# EAGLE design Octaverter Rev 5 (EAGLE 9.0.0)
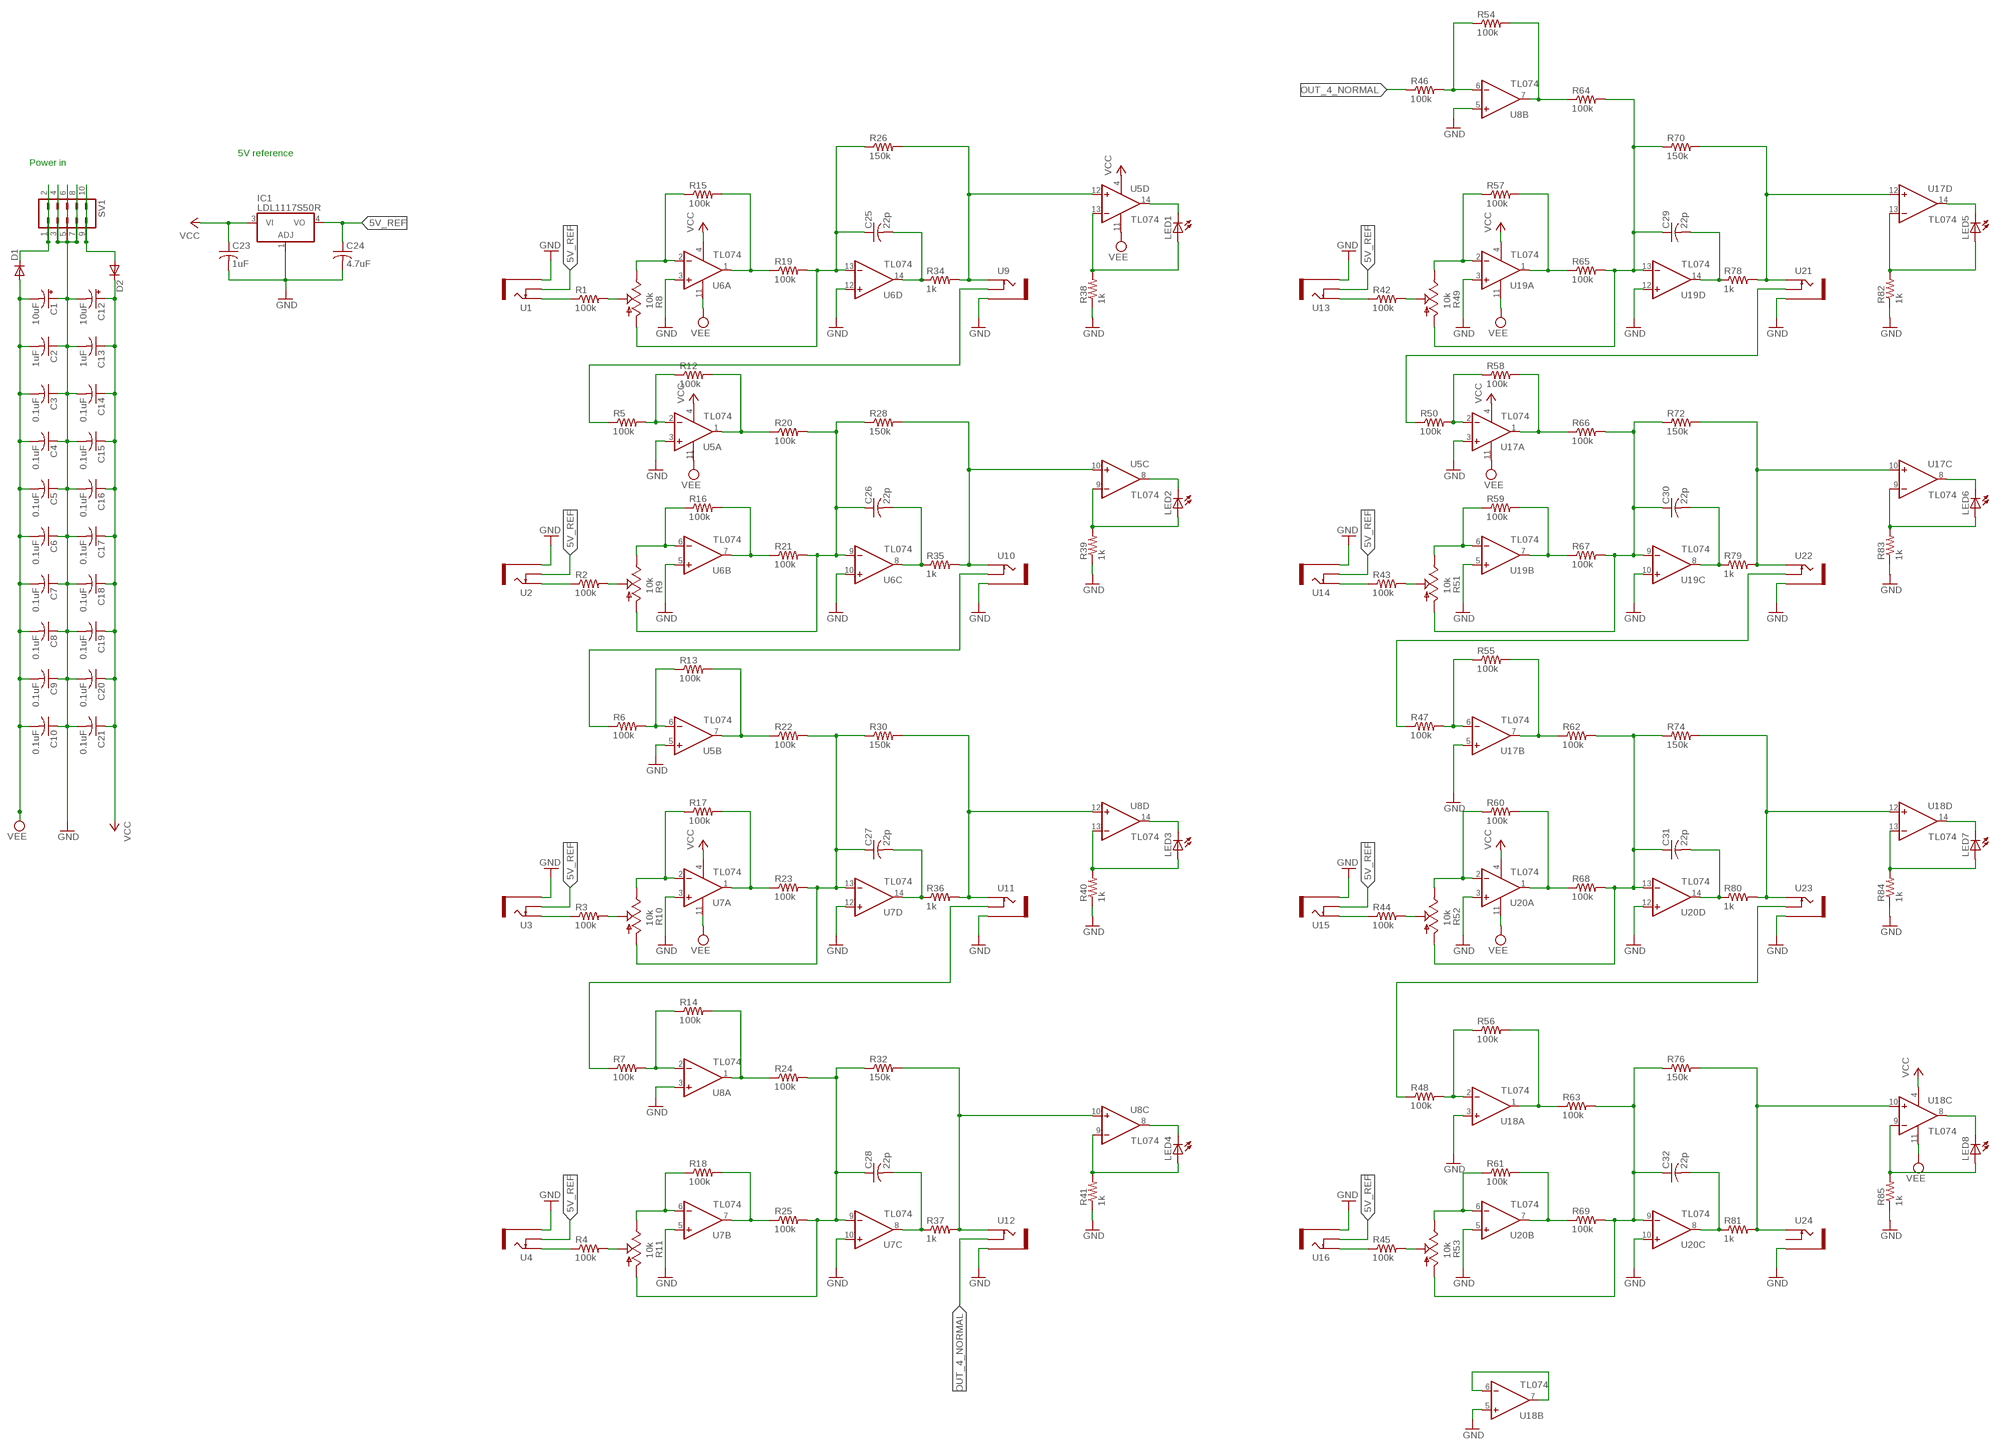
[diagram p0: schematic, sheet 1]

## Parts
C1  10uF  CPOL-USB  [PANASONIC_B]
C2  1uF  C-USC0603  [C0603]
C3  0.1uF  C-USC0603  [C0603]
C4  0.1uF  C-USC0603  [C0603]
C5  0.1uF  C-USC0603  [C0603]
C6  0.1uF  C-USC0603  [C0603]
C7  0.1uF  C-USC0603  [C0603]
C8  0.1uF  C-USC0603  [C0603]
C9  0.1uF  C-USC0603  [C0603]
C10  0.1uF  C-USC0603  [C0603]
C12  10uF  CPOL-USB  [PANASONIC_B]
C13  1uF  C-USC0603  [C0603]
C14  0.1uF  C-USC0603  [C0603]
C15  0.1uF  C-USC0603  [C0603]
C16  0.1uF  C-USC0603  [C0603]
C17  0.1uF  C-USC0603  [C0603]
C18  0.1uF  C-USC0603  [C0603]
C19  0.1uF  C-USC0603  [C0603]
C20  0.1uF  C-USC0603  [C0603]
C21  0.1uF  C-USC0603  [C0603]
C23  1uF  C-USC0603  [C0603]
C24  4.7uF  C-USC0603  [C0603]
C25  22p  C-USC0603  [C0603]
C26  22p  C-USC0603  [C0603]
C27  22p  C-USC0603  [C0603]
C28  22p  C-USC0603  [C0603]
C29  22p  C-USC0603  [C0603]
C30  22p  C-USC0603  [C0603]
C31  22p  C-USC0603  [C0603]
C32  22p  C-USC0603  [C0603]
D1  1N5819HW  DIODE-SOD123  [SOD123]
D2  1N5819HW  DIODE-SOD123  [SOD123]
IC1  LDL1117S50R  317EMP  [SOT223]
LED1  LED3MM  [LED3MM]
LED2  LED3MM  [LED3MM]
LED3  LED3MM  [LED3MM]
LED4  LED3MM  [LED3MM]
LED5  LED3MM  [LED3MM]
LED6  LED3MM  [LED3MM]
LED7  LED3MM  [LED3MM]
LED8  LED3MM  [LED3MM]
R1  100k  R-US_R0603  [R0603]
R2  100k  R-US_R0603  [R0603]
R3  100k  R-US_R0603  [R0603]
R4  100k  R-US_R0603  [R0603]
R5  100k  R-US_R0603  [R0603]
R6  100k  R-US_R0603  [R0603]
R7  100k  R-US_R0603  [R0603]
R8  10k  POT_USVERTICAL_PS  [ALPS_POT_VERTICAL_PS]
R9  10k  POT_USVERTICAL_PS  [ALPS_POT_VERTICAL_PS]
R10  10k  POT_USVERTICAL_PS  [ALPS_POT_VERTICAL_PS]
R11  10k  POT_USVERTICAL_PS  [ALPS_POT_VERTICAL_PS]
R12  100k  R-US_R0603  [R0603]
R13  100k  R-US_R0603  [R0603]
R14  100k  R-US_R0603  [R0603]
R15  100k  R-US_R0603  [R0603]
R16  100k  R-US_R0603  [R0603]
R17  100k  R-US_R0603  [R0603]
R18  100k  R-US_R0603  [R0603]
R19  100k  R-US_R0603  [R0603]
R20  100k  R-US_R0603  [R0603]
R21  100k  R-US_R0603  [R0603]
R22  100k  R-US_R0603  [R0603]
R23  100k  R-US_R0603  [R0603]
R24  100k  R-US_R0603  [R0603]
R25  100k  R-US_R0603  [R0603]
R26  150k  R-US_R0603  [R0603]
R28  150k  R-US_R0603  [R0603]
R30  150k  R-US_R0603  [R0603]
R32  150k  R-US_R0603  [R0603]
R34  1k  R-US_R0603  [R0603]
R35  1k  R-US_R0603  [R0603]
R36  1k  R-US_R0603  [R0603]
R37  1k  R-US_R0603  [R0603]
R38  1k  R-US_R0603  [R0603]
R39  1k  R-US_R0603  [R0603]
R40  1k  R-US_R0603  [R0603]
R41  1k  R-US_R0603  [R0603]
R42  100k  R-US_R0603  [R0603]
R43  100k  R-US_R0603  [R0603]
R44  100k  R-US_R0603  [R0603]
R45  100k  R-US_R0603  [R0603]
R46  100k  R-US_R0603  [R0603]
R47  100k  R-US_R0603  [R0603]
R48  100k  R-US_R0603  [R0603]
R49  10k  POT_USVERTICAL_PS  [ALPS_POT_VERTICAL_PS]
R50  100k  R-US_R0603  [R0603]
R51  10k  POT_USVERTICAL_PS  [ALPS_POT_VERTICAL_PS]
R52  10k  POT_USVERTICAL_PS  [ALPS_POT_VERTICAL_PS]
R53  10k  POT_USVERTICAL_PS  [ALPS_POT_VERTICAL_PS]
R54  100k  R-US_R0603  [R0603]
R55  100k  R-US_R0603  [R0603]
R56  100k  R-US_R0603  [R0603]
R57  100k  R-US_R0603  [R0603]
R58  100k  R-US_R0603  [R0603]
R59  100k  R-US_R0603  [R0603]
R60  100k  R-US_R0603  [R0603]
R61  100k  R-US_R0603  [R0603]
R62  100k  R-US_R0603  [R0603]
R63  100k  R-US_R0603  [R0603]
R64  100k  R-US_R0603  [R0603]
R65  100k  R-US_R0603  [R0603]
R66  100k  R-US_R0603  [R0603]
R67  100k  R-US_R0603  [R0603]
R68  100k  R-US_R0603  [R0603]
R69  100k  R-US_R0603  [R0603]
R70  150k  R-US_R0603  [R0603]
R72  150k  R-US_R0603  [R0603]
R74  150k  R-US_R0603  [R0603]
R76  150k  R-US_R0603  [R0603]
R78  1k  R-US_R0603  [R0603]
R79  1k  R-US_R0603  [R0603]
R80  1k  R-US_R0603  [R0603]
R81  1k  R-US_R0603  [R0603]
R82  1k  R-US_R0603  [R0603]
R83  1k  R-US_R0603  [R0603]
R84  1k  R-US_R0603  [R0603]
R85  1k  R-US_R0603  [R0603]
SV1  EURO_POWER_HEADERFAT_PADS  [EURO_PWR_HEADER_FAT]
U1  THONKICONNNEW  [WQP-PJ301M-12_JACK]
U2  THONKICONNNEW  [WQP-PJ301M-12_JACK]
U3  THONKICONNNEW  [WQP-PJ301M-12_JACK]
U4  THONKICONNNEW  [WQP-PJ301M-12_JACK]
U5  TL074  TL074_SMD  [SO14]
U6  TL074  TL074_SMD  [SO14]
U7  TL074  TL074_SMD  [SO14]
U8  TL074  TL074_SMD  [SO14]
U9  THONKICONNNEW  [WQP-PJ301M-12_JACK]
U10  THONKICONNNEW  [WQP-PJ301M-12_JACK]
U11  THONKICONNNEW  [WQP-PJ301M-12_JACK]
U12  THONKICONNNEW  [WQP-PJ301M-12_JACK]
U13  THONKICONNNEW  [WQP-PJ301M-12_JACK]
U14  THONKICONNNEW  [WQP-PJ301M-12_JACK]
U15  THONKICONNNEW  [WQP-PJ301M-12_JACK]
U16  THONKICONNNEW  [WQP-PJ301M-12_JACK]
U17  TL074  TL074_SMD  [SO14]
U18  TL074  TL074_SMD  [SO14]
U19  TL074  TL074_SMD  [SO14]
U20  TL074  TL074_SMD  [SO14]
U21  THONKICONNNEW  [WQP-PJ301M-12_JACK]
U22  THONKICONNNEW  [WQP-PJ301M-12_JACK]
U23  THONKICONNNEW  [WQP-PJ301M-12_JACK]
U24  THONKICONNNEW  [WQP-PJ301M-12_JACK]

## Nets
5V_REF: C24.1 IC1.4(VO) U1.P$2_SWITCH(SWITCH) U2.P$2_SWITCH(SWITCH) U3.P$2_SWITCH(SWITCH) U4.P$2_SWITCH(SWITCH) U13.P$2_SWITCH(SWITCH) U14.P$2_SWITCH(SWITCH) U15.P$2_SWITCH(SWITCH) U16.P$2_SWITCH(SWITCH)
GND: C1.+ C2.1 C3.1 C4.1 C5.1 C6.1 C7.1 C8.1 C9.1 C10.1 C12.- C13.2 C14.2 C15.2 C16.2 C17.2 C18.2 C19.2 C20.2 C21.2 C23.2 C24.2 IC1.1(ADJ) R38.1 R39.1 R40.1 R41.1 R82.1 R83.1 R84.1 R85.1 SV1.3 SV1.4 SV1.5 SV1.6 SV1.7 SV1.8 U1.P$3_SLEEVE(SLEEVE) U2.P$3_SLEEVE(SLEEVE) U3.P$3_SLEEVE(SLEEVE) U4.P$3_SLEEVE(SLEEVE) U5.3(A:+IN) U5.5(B:+IN) U6.3(A:+IN) U6.5(B:+IN) U6.10(C:+IN) U6.12(D:+IN) U7.3(A:+IN) U7.5(B:+IN) U7.10(C:+IN) U7.12(D:+IN) U8.3(A:+IN) U8.5(B:+IN) U9.P$3_SLEEVE(SLEEVE) U10.P$3_SLEEVE(SLEEVE) U11.P$3_SLEEVE(SLEEVE) U12.P$3_SLEEVE(SLEEVE) U13.P$3_SLEEVE(SLEEVE) U14.P$3_SLEEVE(SLEEVE) U15.P$3_SLEEVE(SLEEVE) U16.P$3_SLEEVE(SLEEVE) U17.3(A:+IN) U17.5(B:+IN) U18.3(A:+IN) U18.5(B:+IN) U19.3(A:+IN) U19.5(B:+IN) U19.10(C:+IN) U19.12(D:+IN) U20.3(A:+IN) U20.5(B:+IN) U20.10(C:+IN) U20.12(D:+IN) U21.P$3_SLEEVE(SLEEVE) U22.P$3_SLEEVE(SLEEVE) U23.P$3_SLEEVE(SLEEVE) U24.P$3_SLEEVE(SLEEVE)
N$1: R1.1 U1.P$1_TIP(TIP)
N$2: R1.2 R8.P$2(S)
N$3: R8.P$1(E) R15.1 U6.2(A:-IN)
N$4: R15.2 R19.1 U6.1(A:OUT)
N$5: C25.1 R8.P$3(A) R19.2 R26.1 U6.13(D:-IN)
N$6: R2.1 U2.P$1_TIP(TIP)
N$7: D1.C SV1.1 SV1.2
N$8: C25.2 R34.1 U6.14(D:OUT)
N$9: R26.2 R34.2 U5.12(D:+IN) U9.P$1_TIP(TIP)
N$10: R16.2 R21.1 U6.7(B:OUT)
N$11: R3.1 U3.P$1_TIP(TIP)
N$12: R3.2 R10.P$2(S)
N$13: C26.2 R35.1 U6.8(C:OUT)
N$14: LED1.K(C) U5.14(D:OUT)
N$15: LED1.A R38.2 U5.13(D:-IN)
N$17: R2.2 R9.P$2(S)
N$18: R9.P$1(E) R16.1 U6.6(B:-IN)
N$19: R50.1 U21.P$2_SWITCH(SWITCH)
N$20: R10.P$1(E) R17.1 U7.2(A:-IN)
N$21: LED2.K(C) U5.8(C:OUT)
N$22: LED2.A R39.2 U5.9(C:-IN)
N$23: D2.A SV1.9 SV1.10
N$24: R17.2 R23.1 U7.1(A:OUT)
N$25: C27.1 R10.P$3(A) R22.2 R23.2 R30.1 U7.13(D:-IN)
N$26: C27.2 R36.1 U7.14(D:OUT)
N$27: U18.6(B:-IN) U18.7(B:OUT)
N$28: R4.2 R11.P$2(S)
N$29: R11.P$1(E) R18.1 U7.6(B:-IN)
N$30: C28.1 R11.P$3(A) R24.2 R25.2 R32.1 U7.9(C:-IN)
N$31: R4.1 U4.P$1_TIP(TIP)
N$32: R18.2 R25.1 U7.7(B:OUT)
N$33: C28.2 R37.1 U7.8(C:OUT)
N$35: LED3.K(C) U8.14(D:OUT)
N$36: LED3.A R40.2 U8.13(D:-IN)
N$37: LED4.K(C) U8.8(C:OUT)
N$38: LED4.A R41.2 U8.9(C:-IN)
N$39: R42.1 U13.P$1_TIP(TIP)
N$40: R42.2 R49.P$2(S)
N$41: R49.P$1(E) R57.1 U19.2(A:-IN)
N$42: R57.2 R65.1 U19.1(A:OUT)
N$43: C29.1 R49.P$3(A) R64.2 R65.2 R70.1 U19.13(D:-IN)
N$44: C29.2 R78.1 U19.14(D:OUT)
N$46: LED5.K(C) U17.14(D:OUT)
N$47: LED5.A R82.2 U17.13(D:-IN)
N$48: R43.2 R51.P$2(S)
N$49: R51.P$1(E) R59.1 U19.6(B:-IN)
N$50: C30.1 R51.P$3(A) R66.2 R67.2 R72.1 U19.9(C:-IN)
N$51: R43.1 U14.P$1_TIP(TIP)
N$52: R59.2 R67.1 U19.7(B:OUT)
N$53: C30.2 R79.1 U19.8(C:OUT)
N$55: LED6.K(C) U17.8(C:OUT)
N$56: LED6.A R83.2 U17.9(C:-IN)
N$57: R44.1 U15.P$1_TIP(TIP)
N$58: R44.2 R52.P$2(S)
N$59: R52.P$1(E) R60.1 U20.2(A:-IN)
N$60: R60.2 R68.1 U20.1(A:OUT)
N$61: C31.1 R52.P$3(A) R62.2 R68.2 R74.1 U20.13(D:-IN)
N$62: C31.2 R80.1 U20.14(D:OUT)
N$64: R45.2 R53.P$2(S)
N$65: R53.P$1(E) R61.1 U20.6(B:-IN)
N$66: C32.1 R53.P$3(A) R63.2 R69.2 R76.1 U20.9(C:-IN)
N$67: R45.1 U16.P$1_TIP(TIP)
N$68: R61.2 R69.1 U20.7(B:OUT)
N$69: C32.2 R81.1 U20.8(C:OUT)
N$71: LED7.A R84.2 U18.13(D:-IN)
N$72: LED8.A R85.2 U18.9(C:-IN)
N$73: LED7.K(C) U18.14(D:OUT)
N$74: LED8.K(C) U18.8(C:OUT)
N$75: R5.1 U9.P$2_SWITCH(SWITCH)
N$76: R5.2 R12.1 U5.2(A:-IN)
N$77: C26.1 R9.P$3(A) R20.2 R21.2 R28.1 U6.9(C:-IN)
N$78: R12.2 R20.1 U5.1(A:OUT)
N$79: R6.1 U10.P$2_SWITCH(SWITCH)
N$80: R6.2 R13.1 U5.6(B:-IN)
N$81: R13.2 R22.1 U5.7(B:OUT)
N$82: R50.2 R58.1 U17.2(A:-IN)
N$83: R7.1 U11.P$2_SWITCH(SWITCH)
N$84: R7.2 R14.1 U8.2(A:-IN)
N$85: R14.2 R24.1 U8.1(A:OUT)
N$86: R58.2 R66.1 U17.1(A:OUT)
N$88: R47.1 U22.P$2_SWITCH(SWITCH)
N$89: R47.2 R55.1 U17.6(B:-IN)
N$90: R55.2 R62.1 U17.7(B:OUT)
N$92: R48.1 U23.P$2_SWITCH(SWITCH)
N$93: R48.2 R56.1 U18.2(A:-IN)
N$94: R56.2 R63.1 U18.1(A:OUT)
N$95: R46.2 R54.1 U8.6(B:-IN)
N$96: R54.2 R64.1 U8.7(B:OUT)
N$97: R30.2 R36.2 U8.12(D:+IN) U11.P$1_TIP(TIP)
N$98: R32.2 R37.2 U8.10(C:+IN) U12.P$1_TIP(TIP)
N$101: R76.2 R81.2 U18.10(C:+IN) U24.P$1_TIP(TIP)
N$102: R28.2 R35.2 U5.10(C:+IN) U10.P$1_TIP(TIP)
N$103: R74.2 R80.2 U18.12(D:+IN) U23.P$1_TIP(TIP)
N$105: R72.2 R79.2 U17.10(C:+IN) U22.P$1_TIP(TIP)
N$107: R70.2 R78.2 U17.12(D:+IN) U21.P$1_TIP(TIP)
OUT_4_NORMAL: R46.1 U12.P$2_SWITCH(SWITCH)
VCC: C12.+ C13.1 C14.1 C15.1 C16.1 C17.1 C18.1 C19.1 C20.1 C21.1 C23.1 D2.C IC1.3(VI) U5.4(P:V+) U6.4(P:V+) U7.4(P:V+) U8.4(P:V+) U17.4(P:V+) U18.4(P:V+) U19.4(P:V+) U20.4(P:V+)
VEE: C1.- C2.2 C3.2 C4.2 C5.2 C6.2 C7.2 C8.2 C9.2 C10.2 D1.A U5.11(P:V-) U6.11(P:V-) U7.11(P:V-) U8.11(P:V-) U17.11(P:V-) U18.11(P:V-) U19.11(P:V-) U20.11(P:V-)
Unconnected: U24.P$2_SWITCH(SWITCH)

## Notes on the sheet
- 5V reference
- Power in

## Library data of the parts
C1 C12 = adafruit:CPOL-US: POLARIZED CAPACITOR, American symbol
C2-C10 C13-C21 C23-C32 = adafruit:C-US: CAPACITOR, American symbol
D1 D2 = diode:DIODE-: DIODE
IC1 = linear:*317: Positive VOLTAGE REGULATOR
LED1-LED8 = adafruit:LED: LED OSRAM: - CHIPLED LG R971, LG N971, LY N971, LG Q971, LY Q971, LO R971, LY R971 LH N974, LH R974 LS Q976, LO Q976, LY Q976 LO Q996 - Hyper CHIPLED LW Q18S LB Q993, LB Q99A, LB R99A - SideLED LS A670, LO A670, LY A670, LG A670, LP A670 LB A673, LV A673, LT A673, LW A673 LH A674 LY A675 LS A676, LA A676, LO A676, LY A676, LW A676 LS A679, LY A679, LG A679 - Hyper Micro SIDELED® LS Y876, LA Y876, LO Y876, LY Y876 LT Y87S - SmartLED LW L88C, LW L88S LB L89C, LB L89S, LG L890 LS L89K, LO L89K, LY L89K LS L896, LA L896, LO L896, LY L896 - TOPLED LS T670, LO T670, LY T670, LG T670, LP T670 LSG T670, LSP T670, LSY T670, LOP T670, LYG T670 LG T671, LOG T671, LSG T671 LB T673, LV T673, LT T673, LW T673 LH T674 LS T676, LA T676, LO T676, LY T676, LB T676, LH T676, LSB T676, LW T676 LB T67C, LV T67C, LT T67C, LS T67K, LO T67K, LY T67K, LW E67C LS E67B, LA E67B, LO E67B, LY E67B, LB E67C, LV E67C, LT E67C LW T67C LS T679, LY T679, LG T679 LS T770, LO T770, LY T770, LG T770, LP T770 LB T773, LV T773, LT T773, LW T773 LH T774 LS E675, LA E675, LY E675, LS T675 LS T776, LA T776, LO T776, LY T776, LB T776 LHGB T686 LT T68C, LB T68C - Hyper Mini TOPLED® LB M676 - Mini TOPLED Santana® LG M470 LS M47K, LO M47K, LY M47K Source: http://www.osram.convergy.de/
R1-R7 R12-R26 R28 R30 R32 R34-R48 R50 R54-R70 R72 R74 R76 R78-R85 = adafruit:R-US_: RESISTOR, American symbol
R8-R11 R49 R51-R53 = pot-alps:POT_US
SV1 = MusicThingModular:EURO_POWER_HEADER: Power Header 10 pin power header for Eurorack Power Supplies Variants with fatter pads for easier soldering, and the LOCK variant which has 5mil offset pins to hold the component in place before soldering
U1-U4 U9-U16 U21-U24 = MusicThingModular:THONKICONN: 3.5mm socket for Eurorack modular synths
U5-U8 U17-U20 = MusicThingModular:TL074: Generic Quad Op Amp

## Board
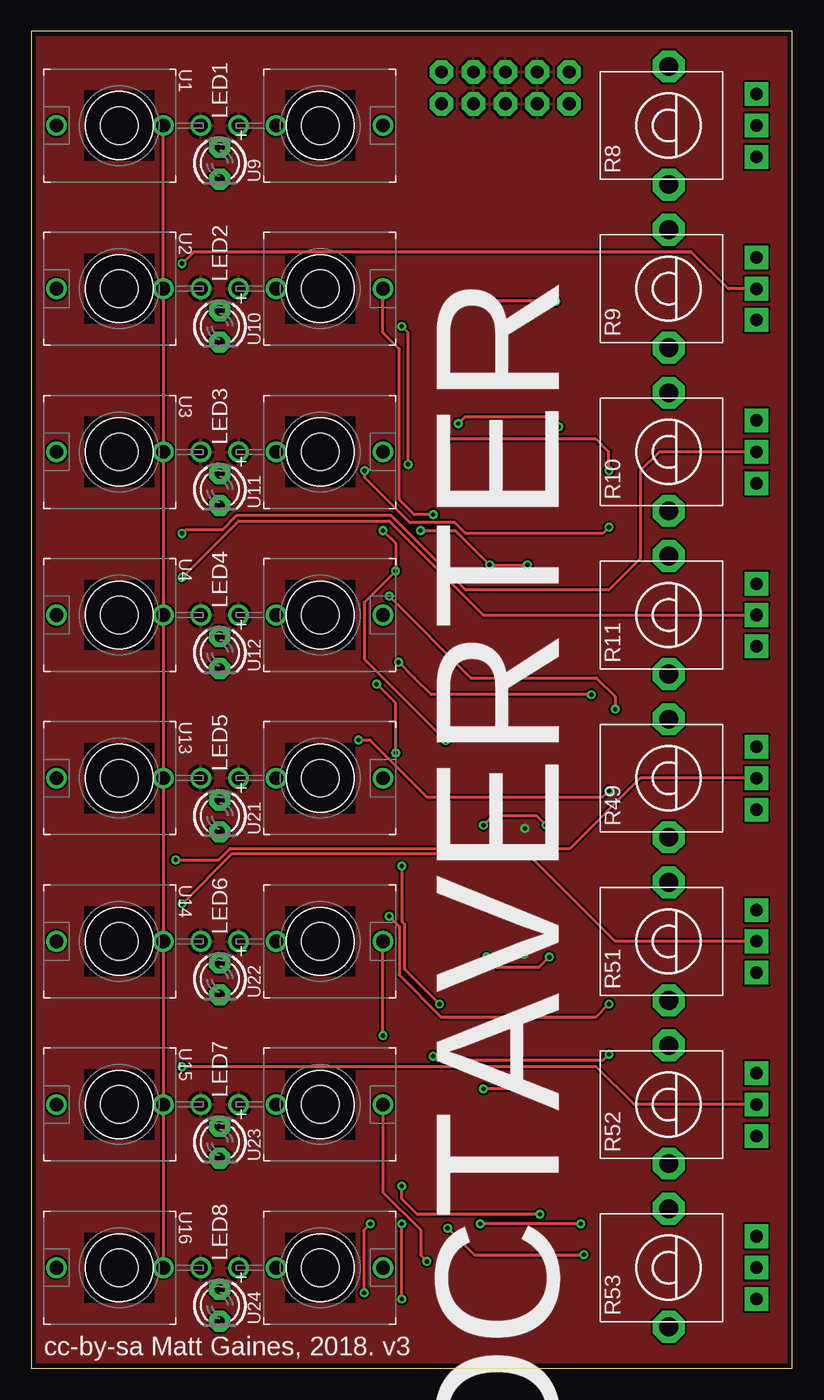
[diagram p1: board, top side]
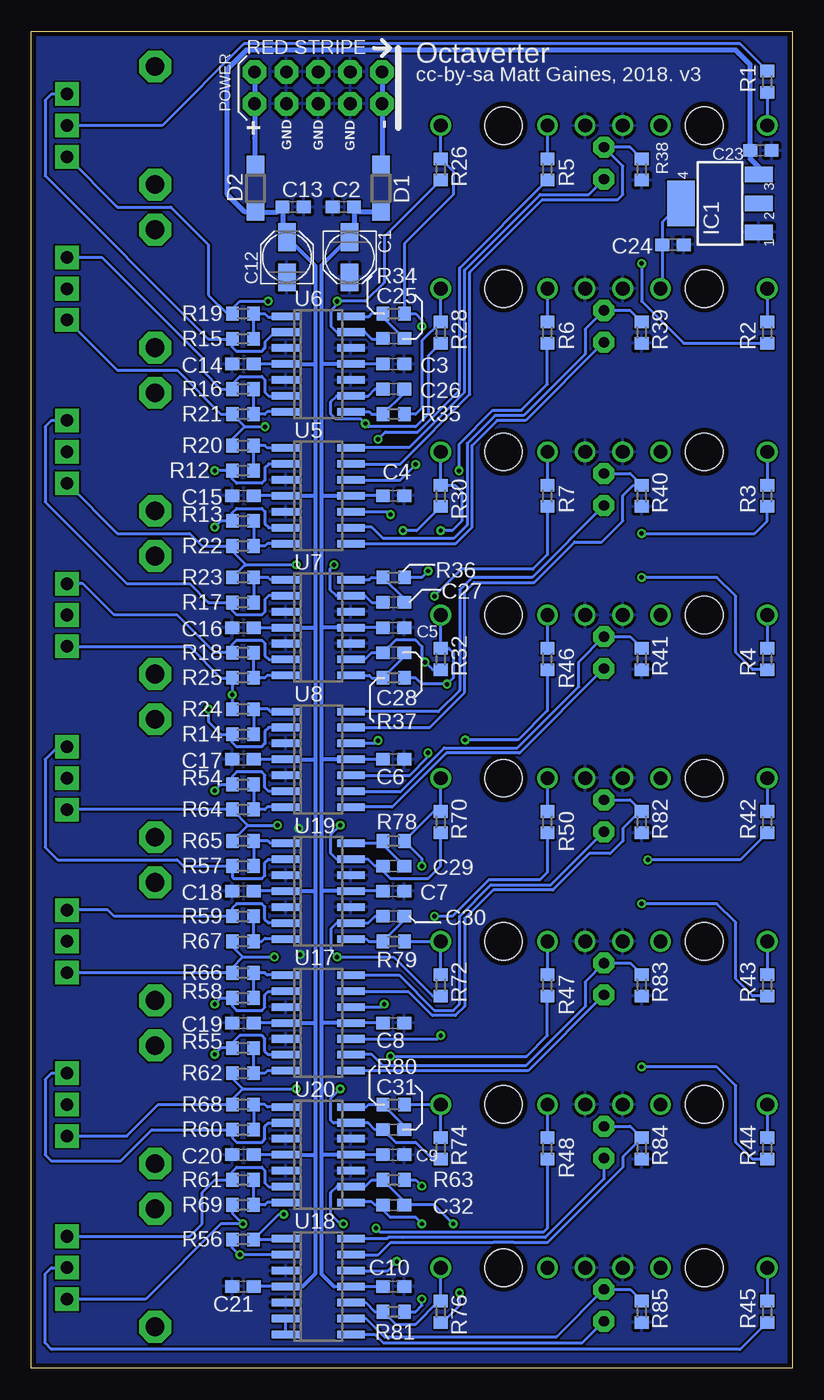
[diagram p2: board, bottom side, seen from below]

Size 60.6 x 106.5 mm. Coordinates in mm from the lower left corner, seen from the top.
Outline: 0,0 60.6,0 60.6,106.5 0,106.5 0,0
Copper layers (1*16): Top 0.0356mm / dielectric 1.5011mm / Bottom 0.0356mm
Design rules "oshpark-2layer": minimum track width 6mil, minimum drill 13mil, track to track 6mil, track to pad 6mil, pad to pad 6mil, via to via 6mil, smd to smd 6mil, copper to edge 15mil, drill to drill 6mil, minimum pad ring 7mil, minimum via ring 7mil, stop-mask expansion 2.5mil, vias tented up to drill 0mil, thermal gap 10mil
Holes 3 mm at 23,99 7,99 7,86 23,86 23,73 7,73 7,60 23,60 23,47 7,47 7,34 23,34 23,21 7,21 7,8 23,8

### Footprints (pad centres in the part's own frame; a part is rotated, then mirrored left to right if it is on the bottom)
PANASONIC_B = smd 2.2 x 1.4: + 1.6,0; - -1.6,0
C0603 = smd 1.1 x 1: 1 -0.85,0; 2 0.85,0
SOD123 = smd 1.4 x 1.4: A 1.9,0; C -1.9,0
SOT223 = smd 1.219 x 2.235: 1 -2.311,-3.099; 2 0,-3.099; 3 2.311,-3.099 | smd 3.6 x 2.2: 4 0,3.099
LED3MM = drill 0.813 pad 1.676 octagon: A -1.27,0; K 1.27,0
R0603 = smd 1 x 1.1: 1 -0.85,0; 2 0.85,0
ALPS_POT_VERTICAL_PS = drill 1 pad 1.88 square: P$1 -2.5,7; P$2 0,7; P$3 2.5,7 | drill 1.5 pad 2.54 octagon: P$4 -4.7,0; P$5 4.7,0
EURO_PWR_HEADER_FAT = drill 1.016 pad 1.88 octagon: 1 -5.08,-1.27; 2 -5.08,1.27; 3 -2.54,-1.27; 4 -2.54,1.27; 5 0,-1.27; 6 0,1.27; 7 2.54,-1.27; 8 2.54,1.27; 9 5.08,-1.27; 10 5.08,1.27
WQP-PJ301M-12_JACK = drill 1.1: P$1_TIP 0,5; P$2_SWITCH 0,-3.5; P$3_SLEEVE 0,-6.5
SO14 = smd 0.6 x 2.2: 1 -3.81,-2.6; 2 -2.54,-2.6; 3 -1.27,-2.6; 4 0,-2.6; 5 1.27,-2.6; 6 2.54,-2.6; 7 3.81,-2.6; 8 3.81,2.6; 9 2.54,2.6; 10 1.27,2.6; 11 0,2.6; 12 -1.27,2.6; 13 -2.54,2.6; 14 -3.81,2.6

### Placement (x,y rotation side)
C1  35.25,88.5 270 bottom
C2  35.75,92.5 0 bottom
C3  31.75,80 180 bottom
C4  31.75,69.5 180 bottom
C5  31.75,59 180 bottom
C6  31.75,48.5 180 bottom
C7  31.75,38 180 bottom
C8  31.75,27.5 180 bottom
C9  31.75,17 180 bottom
C10  31.75,6.5 180 bottom
C12  40.25,88.5 90 bottom
C13  39.75,92.5 0 bottom
C14  43.75,80 180 bottom
C15  43.75,69.5 180 bottom
C16  43.75,59 180 bottom
C17  43.75,48.5 180 bottom
C18  43.75,38 180 bottom
C19  43.75,27.5 180 bottom
C20  43.75,17 180 bottom
C21  43.75,6.5 180 bottom
C23  2.5,97 0 bottom
C24  9.5,89.5 0 bottom
C25  31.74,82.03 0 bottom
C26  31.75,78 0 bottom
C27  31.75,61 0 bottom
C28  31.75,57 0 bottom
C29  31.75,40 0 bottom
C30  31.75,36 0 bottom
C31  31.75,19 0 bottom
C32  31.75,13 180 bottom
D1  32.75,94 270 bottom
D2  42.75,94 90 bottom
IC1  5.76,92.8 90 bottom
LED1  15,96 270 top
LED2  15,83 270 top
LED3  15,70 270 top
LED4  15,57 270 top
LED5  15,44 270 top
LED6  15,31 270 top
LED7  15,18 270 top
LED8  15,5 270 top
R1  2,102.5 90 bottom
R2  2,82.5 270 bottom
R3  2,69.5 270 bottom
R4  2,56.5 270 bottom
R5  19.5,95.5 270 bottom
R6  19.5,82.5 270 bottom
R7  19.5,69.5 270 bottom
R8  50.75,99 270 top
R9  50.75,86 270 top
R10  50.75,73 270 top
R11  50.75,60 270 top
R12  43.75,71.5 0 bottom
R13  43.75,67.5 0 bottom
R14  43.75,50.5 0 bottom
R15  43.75,82 0 bottom
R16  43.75,78 0 bottom
R17  43.75,61 0 bottom
R18  43.75,57 0 bottom
R19  43.75,84 180 bottom
R20  43.75,73.5 180 bottom
R21  43.75,76 180 bottom
R22  43.75,65.5 180 bottom
R23  43.75,63 180 bottom
R24  43.75,52.5 180 bottom
R25  43.75,55 180 bottom
R26  28,95.5 90 bottom
R28  28,82.5 90 bottom
R30  28,69.5 90 bottom
R32  28,56.5 90 bottom
R34  31.75,84 0 bottom
R35  31.75,76 0 bottom
R36  31.75,63 0 bottom
R37  31.75,55 0 bottom
R38  12,95.5 90 bottom
R39  12,82.5 90 bottom
R40  12,69.5 90 bottom
R41  12,56.5 90 bottom
R42  2,43.5 270 bottom
R43  2,30.5 270 bottom
R44  2,17.5 270 bottom
R45  2,4.5 270 bottom
R46  19.5,56.5 270 bottom
R47  19.5,30.5 270 bottom
R48  19.5,17.5 270 bottom
R49  50.75,47 270 top
R50  19.5,43.5 270 bottom
R51  50.75,34 270 top
R52  50.75,21 270 top
R53  50.75,8 270 top
R54  43.75,46.5 0 bottom
R55  43.75,25.5 0 bottom
R56  43.75,10.25 0 bottom
R57  43.75,40 0 bottom
R58  43.75,29.5 0 bottom
R59  43.75,36 0 bottom
R60  43.75,19 0 bottom
R61  43.75,15 0 bottom
R62  43.75,23.5 180 bottom
R63  31.75,15 180 bottom
R64  43.75,44.5 180 bottom
R65  43.75,42 180 bottom
R66  43.75,31.5 180 bottom
R67  43.75,34 180 bottom
R68  43.75,21 180 bottom
R69  43.75,13 180 bottom
R70  28,43.5 90 bottom
R72  28,30.5 90 bottom
R74  28,17.5 90 bottom
R76  28,4.5 90 bottom
R78  31.75,42 0 bottom
R79  31.75,34 0 bottom
R80  31.75,21 0 bottom
R81  31.75,4.5 180 bottom
R82  12,43.5 90 bottom
R83  12,30.5 90 bottom
R84  12,17.5 90 bottom
R85  12,4.5 90 bottom
SV1  37.75,102 180 bottom
U1  7,99 90 top
U2  7,86 90 top
U3  7,73 90 top
U4  7,60 90 top
U5  37.75,69.5 270 bottom
U6  37.75,80 270 bottom
U7  37.75,59 270 bottom
U8  37.75,48.5 270 bottom
U9  23,99 270 top
U10  23,86 270 top
U11  23,73 270 top
U12  23,60 270 top
U13  7,47 90 top
U14  7,34 90 top
U15  7,21 90 top
U16  7,8 90 top
U17  37.75,27.5 270 bottom
U18  37.75,6.5 270 bottom
U19  37.75,38 270 bottom
U20  37.75,17 270 bottom
U21  23,47 270 top
U22  23,34 270 top
U23  23,21 270 top
U24  23,8 270 top

### Tracks (layer width: path | path; a pad name or v marks a point on that pad's centre or on a via)
5V_REF
  Top 0.254: U1.P$2_SWITCH U2.P$2_SWITCH U3.P$2_SWITCH U4.P$2_SWITCH U13.P$2_SWITCH U14.P$2_SWITCH U15.P$2_SWITCH U16.P$2_SWITCH
  Bottom 0.254: IC1.4 10.35,91.31 C24.1 10.35,86.15 U2.P$2_SWITCH
GND  (via drill 0.35)
  other vias: 39.2,32.95 39.3,43
  pour Top: 61,107 61,-1 0,-1 0,107
  pour Bottom: 61,107.5 61,-1 -1,-1 -1,107.5
N$1
  Bottom 0.254: R1.1 U1.P$1_TIP
N$2
  Bottom 0.254: R1.2 4.15,105.5 43.68,105.5 50.18,99 R8.P$2
N$3
  Bottom 0.254: U6.2 41.21,82.54 42,81.75 42,81.25 42.25,81 44.25,81 44.6,81.35 R15.1 46.5,82 59.5,95 59.5,101 59,101.5 R8.P$1
N$4
  Bottom 0.254: R15.2 R19.1 42,84 41.75,83.75 40.41,83.75 U6.1
N$5  (via drill 0.35)
  Top 0.254: v41.75,85 v36.25,85
  Bottom 0.254: C25.1 32.62,82 33.5,82 34.04,82.54 U6.13 36.21,82.54 36.25,82.5 36.75,83 36.75,84.25 36.25,84.75 v36.25,85 34,85 32.5,86.5 32.5,90.15 R26.1 | v41.75,85 44,85 44.6,84.4 R19.2 45,84 46.5,85.5 46.5,89.5 49.5,92.5 53.75,92.5 R8.P$3
N$6
  Bottom 0.254: U2.P$1_TIP R2.1
N$7
  Bottom 0.406: SV1.1 SV1.2 32.67,95.98 D1.C
N$8
  Bottom 0.254: U6.14 35.09,83.75 33.75,83.75 33.5,84 R34.1 32.6,83.74 C25.2
N$9  (via drill 0.35)
  Top 0.254: v30,72 30,82.5 v29.5,83
  Bottom 0.254: U9.P$1_TIP R26.2 27,95.35 27,93.5 30.9,89.6 R34.2 30,84 29.5,83.5 v29.5,83 | U5.12 31.23,70.77 v30,72
N$10
  Bottom 0.254: R16.2 R21.1 42,76 41.81,76.19 U6.7
N$11
  Bottom 0.254: U3.P$1_TIP R3.1
N$12  (via drill 0.35)
  Top 0.254: R10.P$2 50,73 48.5,71.5 48.5,64.5 46,62 34.58,62 28.67,67.91 16.33,67.91 15.21,66.79 12.29,66.79 v12,66.5
  Bottom 0.254: v12,66.5 3,66.5 2,67.5 R3.2
N$13
  Bottom 0.254: U6.8 33.69,76.19 33.5,76 R35.1 30.9,77.7 C26.2
N$14
  Bottom 0.254: U5.14 35.09,73.37 30.48,73.37 26.09,77.76 26.09,87.48 20.07,93.5 16.23,93.5 LED1.K
N$15
  Bottom 0.254: R38.2 12.92,97.27 LED1.A 13.5,95.77 13.5,93.5 13.91,93.09 19.91,93.09 25.69,87.31 25.69,77.59 31.24,72.04 U5.13
N$17  (via drill 0.35)
  Top 0.254: R9.P$2 55.5,86 52.57,88.93 12.93,88.93 v12,88
  Bottom 0.254: v12,88 12,85 8.65,81.65 R2.2
N$18
  Bottom 0.254: U6.6 41.71,77.46 42,77.75 42,78.75 42.25,79 44,79 44.6,78.4 R16.1 45.5,78 47,79.5 47,80.5 55,88.5 R9.P$1
N$19
  Bottom 0.254: U21.P$2_SWITCH R50.1
N$20
  Bottom 0.254: U7.2 41.71,61.54 42,61.25 42,60.25 42.25,60 44.25,60 44.6,60.35 R17.1 46.5,61 48,62.5 53,62.5 59.5,69 59.5,75 59,75.5 R10.P$1
N$21
  Bottom 0.254: LED2.K 21.23,75.5 23.5,75.5 25.5,73.5 25.5,67 26.81,65.69 U5.8
N$22
  Bottom 0.254: R39.2 12.92,84.27 LED2.A 16.5,82.77 16.5,80.81 21.4,75.91 23.67,75.91 25.91,73.67 25.91,67.17 26.98,66.1 32.6,66.1 33.5,67 35.11,67 U5.9
N$23
  Bottom 0.406: SV1.9 SV1.10 42.83,98 42.83,95.98 D2.A
N$24
  Bottom 0.254: U7.1 41.56,62.81 41.75,63 R23.1 R17.2
N$25  (via drill 0.35)
  Top 0.254: v39.5,64 v36.5,64 33.77,66.73 v31,66.73
  Bottom 0.254: C27.1 33.5,61 34.04,61.54 U7.13 36.34,61.54 36.8,62 36.8,63.7 v36.5,64 | R10.P$3 53.75,66.5 48,66.5 47,65.5 R22.2 44.6,65.1 43.5,64 | v39.5,64 43.5,64 | R23.2 43.6,64 43.5,64 | R30.1 29.92,66.73 v31,66.73
N$26
  Bottom 0.254: U7.14 33.69,62.81 33.5,63 R36.1 30.9,61.3 C27.2
N$27
  Bottom 0.254: U18.7 U18.6
N$28  (via drill 0.35)
  Top 0.254: v12,63 16.5,67.5 28.5,67.5 36,60 R11.P$2
  Bottom 0.254: R4.2 3.15,55.65 4.5,57 4.5,61.5 6,63 v12,63
N$29
  Bottom 0.254: U7.6 41.71,56.46 42,56.75 42,57.75 42.25,58 44.25,58 44.6,57.65 R18.1 46,57 49,60 54,60 56.5,62.5 R11.P$1
N$30  (via drill 0.35)
  Top 0.254: v44.6,53.65 31.85,53.65 30.5,55 v29.25,56.25
  Bottom 0.254: U7.9 34.04,56.46 33.5,57 C28.1 31.6,58 30,58 29.5,57.5 29.5,56.5 v29.25,56.25 28.65,55.65 R32.1 | R11.P$3 48,57.5 45.5,55 R25.2 v44.6,53.65 R24.2
N$31
  Bottom 0.254: U4.P$1_TIP R4.1
N$32
  Bottom 0.254: U7.7 41.81,55.19 42,55 R25.1 R18.2
N$33
  Bottom 0.254: U7.8 33.69,55.19 33.5,55 R37.1 30.9,56.7 C28.2
N$35
  Bottom 0.254: LED3.K 20.73,63 25.5,63 26.5,62 26.5,54 28.19,52.31 U8.14
N$36
  Bottom 0.254: LED3.A 12.92,71.27 R40.2 12.65,70.35 13.5,69.5 13.5,67.5 15.17,65.83 17.33,65.83 20.56,62.59 25.33,62.59 26.09,61.83 26.09,53.83 28.89,51.04 U8.13
N$37
  Bottom 0.254: LED4.K 21.72,49.01 27.55,49.01 31.87,44.69 U8.8
N$38
  Bottom 0.254: R41.2 12.92,58.27 LED4.A 17,56.27 17,54.3 21.89,49.41 27.72,49.41 31.18,45.96 U8.9
N$39
  Bottom 0.254: U13.P$1_TIP R42.1
N$40  (via drill 0.35)
  Top 0.254: v11.5,40.5 14.93,40.5 15.83,41.41 42.91,41.41 48.5,47 R49.P$2
  Bottom 0.254: R42.2 4.15,40.5 v11.5,40.5
N$41
  Bottom 0.254: U19.2 41.71,40.54 42,40.25 42,39.25 42.25,39 44.5,39 44.6,39.1 R57.1 48.5,40 49,40.5 58.5,40.5 59.5,41.5 59.5,48.5 58.5,49.5 R49.P$1
N$42
  Bottom 0.254: U19.1 41.56,41.81 41.75,42 R65.1 R57.2
N$43  (via drill 0.35)
  Top 0.254: v41,43.25 40.25,44 36.75,44 v36,43.25
  Bottom 0.254: R65.2 43.35,43.25 | 43.35,43.25 v41,43.25 | 43.35,43.25 R64.2 R49.P$3 | v36,43.25 36.75,42.5 36.75,41 36.29,40.54 U19.13 33.79,40.54 33.25,40 C29.1 32.6,39.6 32,39 29,39 28,40 R70.1
N$44
  Bottom 0.254: R78.1 32.67,41.92 | 32.67,41.92 32.79,41.81 U19.14 | C29.2 32.67,41.77 32.67,41.92
N$46
  Bottom 0.254: U17.14 31.31,31.31 28.5,28.5 27,28.5 26.5,29 26.5,36 24,38.5 19.23,38.5 LED5.K
N$47
  Bottom 0.254: LED5.A 12.92,45.27 R82.2 12.15,44.35 13.5,43 13.5,42 14.5,41 16.16,41 19.06,38.09 23.83,38.09 26.09,35.83 26.09,28.83 26.83,28.09 28.67,28.09 30.54,29.96 35.07,29.96 U17.13
N$48  (via drill 0.35)
  Top 0.254: v12,37 16,41 39.5,41 46.5,34 R51.P$2
  Bottom 0.254: R43.2 3.15,29.65 4.5,31 4.5,35.5 6,37 v12,37
N$49
  Bottom 0.254: U19.6 41.71,35.46 42,35.75 42,36.75 42.25,37 44.25,37 44.6,36.65 R59.1 54,36 54.5,36.5 R51.P$1
N$50  (via drill 0.35)
  Top 0.254: v41.25,32.75 40.41,31.91 37.09,31.91 v36.25,32.75
  Bottom 0.254: 33,36 C30.1 33.25,36 33.79,35.46 U19.9 36.29,35.46 36.75,35 36.75,33.25 v36.25,32.75 31.75,32.75 28.65,29.65 R72.1 | R67.2 44.6,33.6 43.75,32.75 | 43.75,32.75 44.6,31.9 R66.2 R51.P$3 | 43.75,32.75 v41.25,32.75
N$51
  Bottom 0.254: U14.P$1_TIP R43.1
N$52
  Bottom 0.254: R59.2 R67.1 42.25,34 42,34.25 40.41,34.25 U19.7
N$53
  Bottom 0.254: C30.2 30.9,35.7 R79.1 33.75,34 33.94,34.19 U19.8
N$55
  Bottom 0.254: LED6.K 21.04,23.69 U17.8
N$56
  Bottom 0.254: R83.2 12.92,32.27 LED6.A 16.5,30.77 16.5,28.8 21.21,24.1 32.6,24.1 33.5,25 35.11,25 U17.9
N$57
  Bottom 0.254: U15.P$1_TIP R44.1
N$58  (via drill 0.35)
  Top 0.254: v12,24 45,24 48,21 R52.P$2
  Bottom 0.254: R44.2 3.15,16.65 4.5,18 4.5,22.5 6,24 v12,24
N$59
  Bottom 0.254: U20.2 41.71,19.54 42,19.25 42,18.25 42.25,18 44.25,18 44.6,18.35 R60.1 51,19 53.5,16.5 59,16.5 59.5,17 59.5,23 59,23.5 R52.P$1
N$60
  Bottom 0.254: U20.1 41.81,20.81 42,21 R68.1 R60.2
N$61  (via drill 0.35)
  Top 0.254: v39.5,22.25 v36,22.25
  Bottom 0.254: R62.2 44.6,23.1 43.75,22.25 | 43.75,22.25 v39.5,22.25 | v36,22.25 36.75,21.5 36.75,19.75 36.54,19.54 U20.13 33.79,19.54 33.25,19 C31.1 31.6,18 30,18 28.65,16.65 R74.1 | 43.75,22.25 44.6,21.4 R68.2 50.5,21 53,18.5 R52.P$3
N$62
  Bottom 0.254: U20.14 33.94,20.81 33.75,21 R80.1 30.9,19.3 C31.2
N$64
  Bottom 0.254: R45.2 4.15,1.5 59,1.5 59.5,2 59.5,7.5 59,8 R53.P$2
N$65
  Bottom 0.254: U20.6 41.71,14.46 42,14.75 42,15.75 42.25,16 44.25,16 44.6,15.65 R61.1 46,15 47,14 47,11.5 48,10.5 R53.P$1
N$66  (via drill 0.35)
  Top 0.254: v43.75,11.5 v35.75,11.5 | v26.5,6 26.5,11 v27,11.5
  Bottom 0.254: R69.2 44.6,12.35 v43.75,11.5 45.5,11.5 51.5,5.5 R53.P$3 | v35.75,11.5 36,11.5 36.75,12.25 36.75,14 36.25,14.5 36.21,14.46 U20.9 34.04,14.46 33.5,15 R63.2 30.9,13.3 C32.1 28.5,13 v27,11.5 | R76.1 27.85,3.65 26.5,5 v26.5,6
N$67
  Bottom 0.254: U16.P$1_TIP R45.1
N$68
  Bottom 0.254: U20.7 41.81,13.19 42,13 R69.1 R61.2
N$69  (via drill 0.35)
  Top 0.254: v29.5,5.5 v29.5,11.5
  Bottom 0.254: U20.8 35.09,13.25 33.5,13.25 33.25,13 C32.2 32.6,12.6 32,12 30,12 v29.5,11.5 | R81.1 30,4.5 29.5,5 v29.5,5.5
N$71
  Bottom 0.254: LED7.A 12.92,19.27 R84.2 13.5,16.85 13.5,16 19.5,10 22.16,10 22.17,10.01 23.83,10.01 23.84,10 32,10 33,9 35.11,9 U18.13
N$72
  Bottom 0.254: R85.2 12.92,6.27 LED8.A 18.77,2.5 32.5,2.5 33.96,3.96 U18.9
N$73
  Bottom 0.254: LED7.K 15,15.07 19.66,10.41 31,10.41 32.16,10.41 32.27,10.31 U18.14
N$74
  Bottom 0.254: LED8.K 16.73,2 32.58,2 33.27,2.69 U18.8
N$75
  Bottom 0.254: U9.P$2_SWITCH 19.5,97.5 R5.1
N$76  (via drill 0.35)
  Top 0.254: v46,71.5 46,73 45,74 v33,74
  Bottom 0.254: U5.2 41.71,72.04 42,71.75 42,70.75 42.25,70.5 44.25,70.5 44.6,70.85 R12.1 v46,71.5 | v33,74 32.41,74.59 29.83,74.59 26.5,77.92 26.5,87.65 R5.2
N$77  (via drill 0.35)
  Top 0.254: v42,75 41.25,75.75 34.5,75.75 v34,75.25
  Bottom 0.254: C26.1 33.25,78 33.79,77.46 U6.9 36.29,77.46 36.75,77 36.75,76 36.53,75.78 36.53,75.77 36.37,75.61 34.36,75.61 v34,75.25 33.75,75 30,75 29,76 29,80.65 R28.1 | 43.6,75 R21.2 45.5,76 49,79.5 53.75,79.5 R9.P$3 | 43.6,75 v42,75 | R20.2 44.6,74 43.6,75
N$78
  Bottom 0.254: U5.1 41.81,73.31 42,73.5 R20.1 R12.2
N$79
  Bottom 0.254: U10.P$2_SWITCH R6.1
N$80  (via drill 0.35)
  Top 0.254: v46,67 45.5,66.5 34.58,66.5 33.71,67.36 30.14,67.36 26.54,70.96 v26.54,71.5
  Bottom 0.254: U5.6 41.71,66.96 42,67.25 42,68.25 42.25,68.5 44.25,68.5 44.6,68.15 R13.1 45.5,67.5 v46,67 | v26.54,71.5 26.54,73.61 23.84,76.31 21.57,76.31 19.5,78.38 R6.2
N$81
  Bottom 0.254: U5.7 41.81,65.69 42,65.5 R22.1 R13.2
N$82  (via drill 0.35)
  Top 0.254: v28.5,36 29.29,35.21 29.29,31.31 32.61,28 45,28 v46,29
  Bottom 0.254: U17.2 40.39,30 41.75,30 42,29.75 42,28.75 42.25,28.5 44.25,28.5 44.6,28.85 R58.1 45.5,29.5 v46,29 | R50.2 19.5,39.5 20.09,38.91 24.17,38.91 27.07,36 v28.5,36
N$83
  Bottom 0.254: U11.P$2_SWITCH R7.1
N$84  (via drill 0.35)
  Top 0.254: v28.5,61.5 35,55 45,55 46.5,53.5 v46.5,52.5
  Bottom 0.254: U8.2 41.71,51.04 42,50.75 42,49.75 42.25,49.5 44.25,49.5 44.6,49.85 R14.1 45.5,50.5 46.5,51.5 v46.5,52.5 | R7.2 19.5,64.81 20.65,63.65 26.35,63.65 v28.5,61.5
N$85
  Bottom 0.254: U8.1 41.56,52.31 41.75,52.5 R24.1 R14.2
N$86
  Bottom 0.254: U17.1 41.81,31.31 42,31.5 R66.1 R58.2
N$88
  Bottom 0.254: U22.P$2_SWITCH R47.1
N$89  (via drill 0.35)
  Top 0.254: v46,25 45.5,24.5 32.35,24.5 v32,24.85
  Bottom 0.254: U17.6 41.71,24.96 42,25.25 42,26.25 42.25,26.5 44,26.5 44.6,25.9 R55.1 45.5,25.5 v46,25 | v32,24.85 21.15,24.85 19.5,26.5 R47.2
N$90
  Bottom 0.254: U17.7 41.81,23.69 42,23.5 R62.1 R55.2
N$92
  Bottom 0.254: U23.P$2_SWITCH R48.1
N$93  (via drill 0.35)
  Top 0.254: v33.15,11.15 35.26,9.04 v44,9.04
  Bottom 0.254: U18.2 v44,9.04 44.04,9.04 44.6,9.6 R56.1 | R48.2 19.5,11.15 19.82,10.82 32.83,10.82 v33.15,11.15
N$94  (via drill 0.35)
  Top 0.254: v29.5,14.5 29.5,13.5 30.75,12.25 v40.5,12.25
  Bottom 0.254: U18.1 40.41,10.25 R56.2 40.9,12.25 v40.5,12.25 | R63.1 30,15 v29.5,14.5
N$95  (via drill 0.35)
  Top 0.254: v26.05,50.05 26.95,50.05 31.5,45.5 45.5,45.5 v46,46
  Bottom 0.254: U8.6 41.71,45.96 42,46.25 42,47.25 42.25,47.5 44.25,47.5 44.6,47.15 R54.1 45.5,46.5 v46,46 | R46.2 19.5,52.38 21.83,50.05 v26.05,50.05
N$96
  Bottom 0.254: U8.7 41.81,44.69 42,44.5 R64.1 R54.2
N$97  (via drill 0.35)
  Top 0.254: v28,66.73 29,65.73 v29,63.5 26.5,61 26.5,56.5 v33,50
  Bottom 0.254: U11.P$1_TIP R30.2 26.85,70.35 26.31,69.81 26.31,67.5 27.08,66.73 v28,66.73 | v29,63.5 29.5,63 R36.2 | v33,50 33.23,49.77 U8.12
N$98  (via drill 0.35)
  Top 0.254: v29.02,49.02 29.02,52.98 v27.5,54.5
  Bottom 0.254: U12.P$1_TIP R32.2 27.35,57.35 27,57 27,55 v27.5,54.5 29.5,54.5 30,55 R37.2 | U8.10 30.48,47.23 29.02,48.7 v29.02,49.02
N$101
  Bottom 0.254: U18.10 33.98,5.23 33.25,4.5 R81.2 31.6,3.5 30,3.5 28.15,5.35 R76.2 U24.P$1_TIP
N$102  (via drill 0.35)
  Top 0.254: v32,68 30.5,68 29.3,69.2 29.3,81.2 28,82.5 U10.P$1_TIP
  Bottom 0.254: U10.P$1_TIP R28.2 29.5,81.85 29.5,76.5 30,76 R35.2 | U5.10 32.23,68.23 v32,68
N$103  (via drill 0.35)
  Top 0.254: v31.5,8.5 31,9 31,11 28,14 U23.P$1_TIP
  Bottom 0.254: R74.2 U23.P$1_TIP R80.2 | U18.12 32.23,7.77 v31.5,8.5
N$105  (via drill 0.35)
  Top 0.254: v28,26.5 U22.P$1_TIP
  Bottom 0.254: R72.2 U22.P$1_TIP R79.2 | U17.10 28.27,26.23 v28,26.5
N$107  (via drill 0.35)
  Top 0.254: v32.5,29 29.7,31.8 29.7,35.38 29.5,35.58 v29.5,40
  Bottom 0.254: U21.P$1_TIP R70.2 28.55,44.35 R78.2 29.5,40.6 v29.5,40 | U17.12 32.73,28.77 v32.5,29
OUT_4_NORMAL
  Bottom 0.254: U12.P$2_SWITCH R46.1
VCC
  Bottom 0.254: U20.4 C20.1 | U17.4 C19.1 | U19.4 C18.1 | U8.4 C17.1 | U5.4 C15.1 | U6.4 C14.1 | C16.1 U7.4 | C21.1 U18.4 39,6.5
  Bottom 0.305: C12.+ 38,87.85 38,80 | 38,80 38,69.5 | 38,69.5 38,59 | 38,59 38,48.5 | 38,48.5 38,38 | 38,38 38,27.5 | 38,27.5 38,17 | 38,17 38,7.5 39,6.5 | U6.4 38,80 | U5.4 38,69.5 | U8.4 38,48.5 | U19.4 38,38 | U17.4 38,27.5 | U20.4 38,17 | U7.4 38,59
  Bottom 0.406: C12.+ 40.6,90.45 C13.1 41,92.1 D2.C 43.6,92.1 45,93.5 45,103.5 43.5,105 4.5,105 3.35,103.85 C23.1 3.35,96.35 2.66,95.66 IC1.3
VEE
  Bottom 0.254: C3.2 U6.11 | C4.2 U5.11 | C5.2 U7.11 | C6.2 U8.11 | C7.2 U19.11 | C8.2 U17.11 | C9.2 U20.11 | 36.5,6.5 U18.11 C10.2
  Bottom 0.305: C1.- 37.5,87.85 37.5,80 | 37.5,80 37.5,69.5 | 37.5,69.5 37.5,59 | 37.5,59 37.5,48.5 | 37.5,48.5 37.5,38 | 37.5,38 37.5,27.5 | 37.5,27.5 37.5,17 | 37.5,17 37.5,7.5 36.5,6.5 | U6.11 37.5,80 | 37.5,69.5 U5.11 | U7.11 37.5,59 | U8.11 37.5,48.5 | U19.11 37.5,38 | U17.11 37.5,27.5 | U20.11 37.5,17
  Bottom 0.406: D1.A 34.5,92.1 C2.2 34.9,90.45 C1.-

### Text on the board
tPlace: OCTAVERTER | cc-by-sa Matt Gaines, 2018. v3
bPlace: Octaverter | cc-by-sa Matt Gaines, 2018. v3